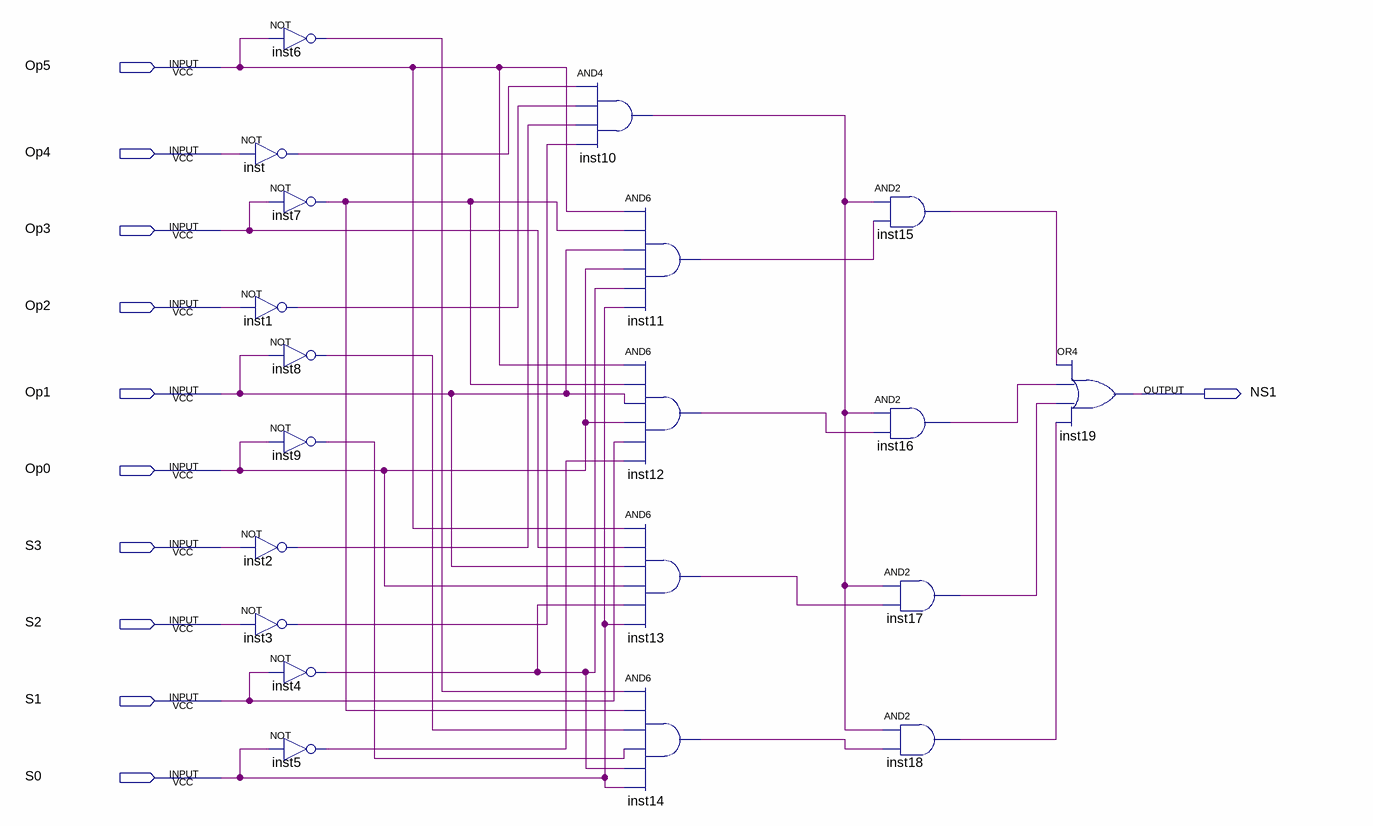
[diagram p0: schematic sheet]
// Quartus schematic NS1.bdf as structural Verilog: 20 symbols, 11 pins
module NS1 (
  input  Op5,
  input  Op4,
  input  Op3,
  input  Op2,
  input  Op1,
  input  Op0,
  input  S3,
  input  S2,
  input  S1,
  input  S0,
  output NS1
);

  wire inst1_out, inst2_out, inst3_out, inst4_out, inst5_out, inst6_out, inst7_out, inst8_out, inst9_out,
       inst10_out, inst11_out, inst12_out, inst13_out, inst14_out, inst15_out, inst16_out, inst17_out,
       inst18_out, inst_out;

  not inst6 (inst6_out, Op5);
  not inst (inst_out, Op4);
  not inst7 (inst7_out, Op3);
  not inst1 (inst1_out, Op2);
  not inst8 (inst8_out, Op1);
  not inst9 (inst9_out, Op0);
  not inst2 (inst2_out, S3);
  not inst3 (inst3_out, S2);
  not inst4 (inst4_out, S1);
  not inst5 (inst5_out, S0);
  and inst10 (inst10_out, inst_out, inst1_out, inst2_out, inst3_out);
  and inst11 (inst11_out, Op5, inst7_out, Op1, Op0, inst4_out, S0);
  and inst12 (inst12_out, Op5, inst7_out, Op1, Op0, S1, inst5_out);
  and inst13 (inst13_out, Op5, Op3, Op1, Op0, inst4_out, S0);
  and inst14 (inst14_out, inst6_out, inst7_out, inst8_out, inst9_out, inst4_out, S0);
  and inst15 (inst15_out, inst10_out, inst11_out);
  and inst16 (inst16_out, inst10_out, inst12_out);
  and inst17 (inst17_out, inst10_out, inst13_out);
  and inst18 (inst18_out, inst10_out, inst14_out);
  or inst19 (NS1, inst15_out, inst16_out, inst17_out, inst18_out);
endmodule
